# Altium schematic sheet FourierHT.SchDoc
size A4; SheetNumber: 9; SheetTotal: 9
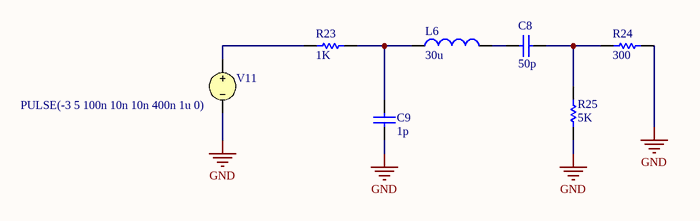
[diagram p0: FourierHT.SchDoc]

## Parts
C8  value 50p  (hidden comment: Capacitor)
C9  value 1p  (hidden comment: Capacitor)
L6  value 30u  (hidden comment: Inductor)
R23  value 1K  (hidden comment: Resistor)
R24  value 300  (hidden comment: Resistor)
R25  value 5K  (hidden comment: Resistor)
V11  PULSE(-3 5 100n 10n 10n 400n 1u 0)

## Nets
GND: C9.1 R24.2 R25.1 V11.2
NetC8_1: C8.1 R24.1 R25.2
NetC8_2: C8.2 L6.2
NetC9_2: C9.2 L6.1 R23.2
NetR23_1: R23.1 V11.1

## Library data of the parts
C8 C9 = Capacitor: SimulationGenericComponent: True
L6 = Inductor: SimulationGenericComponent: True
R23-R25 = Resistor: TC1: 0; SimulationGenericComponent: True; TC2: 0
V11 = VSRC: Voltage Source; Note: PCB Footprint - Not required; AC Magnitude: 1; AC Phase: 0; DC Magnitude: 5; Published: 8-Jun-2000; LatestRevisionDate: 17-Jul-2002; LatestRevisionNote: Re-released for DXP Platform.; PackageReference: Not Applicable; Publisher: Altium Limited; Initial Value: -3; Pulsed Value: 5; Time Delay: 100n; Rise Time: 10n; Fall Time: 10n; Pulse Width: 400n; Period: 1u; Phase: 0